# EAGLE schematic Ultrasonic_sensor_switch (EAGLE 7.5.0)
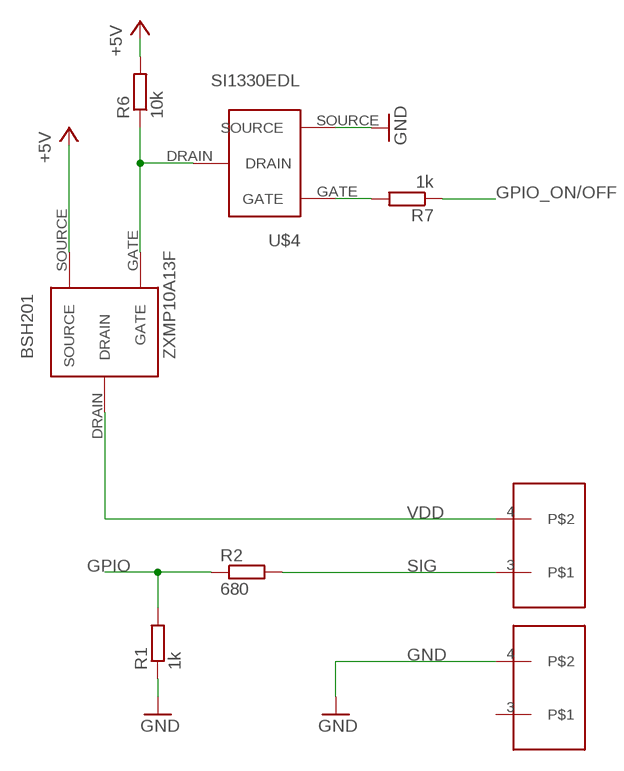
[diagram p0: schematic, sheet 1]

## Parts
BSH201  ZXMP10A13F  [P-CHANNEL]
R1  1k  R-EU_R0805  [R0805]
R2  680  R-EU_R0805  [R0805]
R6  10k  R-EU_R0805  [R0805]
R7  1k  R-EU_R0805  [R0805]
SKRUVPLINT_2P1  SKRUVPLINT_2P  [SKRUVPLINT_2P]
SKRUVPLINT_2P2  SKRUVPLINT_2P  [SKRUVPLINT_2P]
U$4  SI1330EDL  [SOT-323]

## Nets
+5V: BSH201.SOURCE R6.2
GND: R1.1 SKRUVPLINT_2P2.4 U$4.SOURCE
GPIO: R1.2 R2.1
GPIO_ON/OFF: R7.1
N$3: BSH201.GATE R6.1 U$4.DRAIN
N$4: R7.2 U$4.GATE
SIG: R2.2 SKRUVPLINT_2P1.3
VDD: BSH201.DRAIN SKRUVPLINT_2P1.4
Unconnected: SKRUVPLINT_2P2.3

## Library data of the parts
BSH201 = ZXMP10A13F:ZXMP10A13F
R1 R2 R6 R7 = rcl:R-EU_: RESISTOR, European symbol
SKRUVPLINT_2P1 SKRUVPLINT_2P2 = skruvplint2p_CTB0700:SKRUVPLINT_2P
U$4 = SI1330EDL:SI1330EDL